# EAGLE design Arduino MEGA Ultimaker Shield v1.5.6 (EAGLE 5.10)
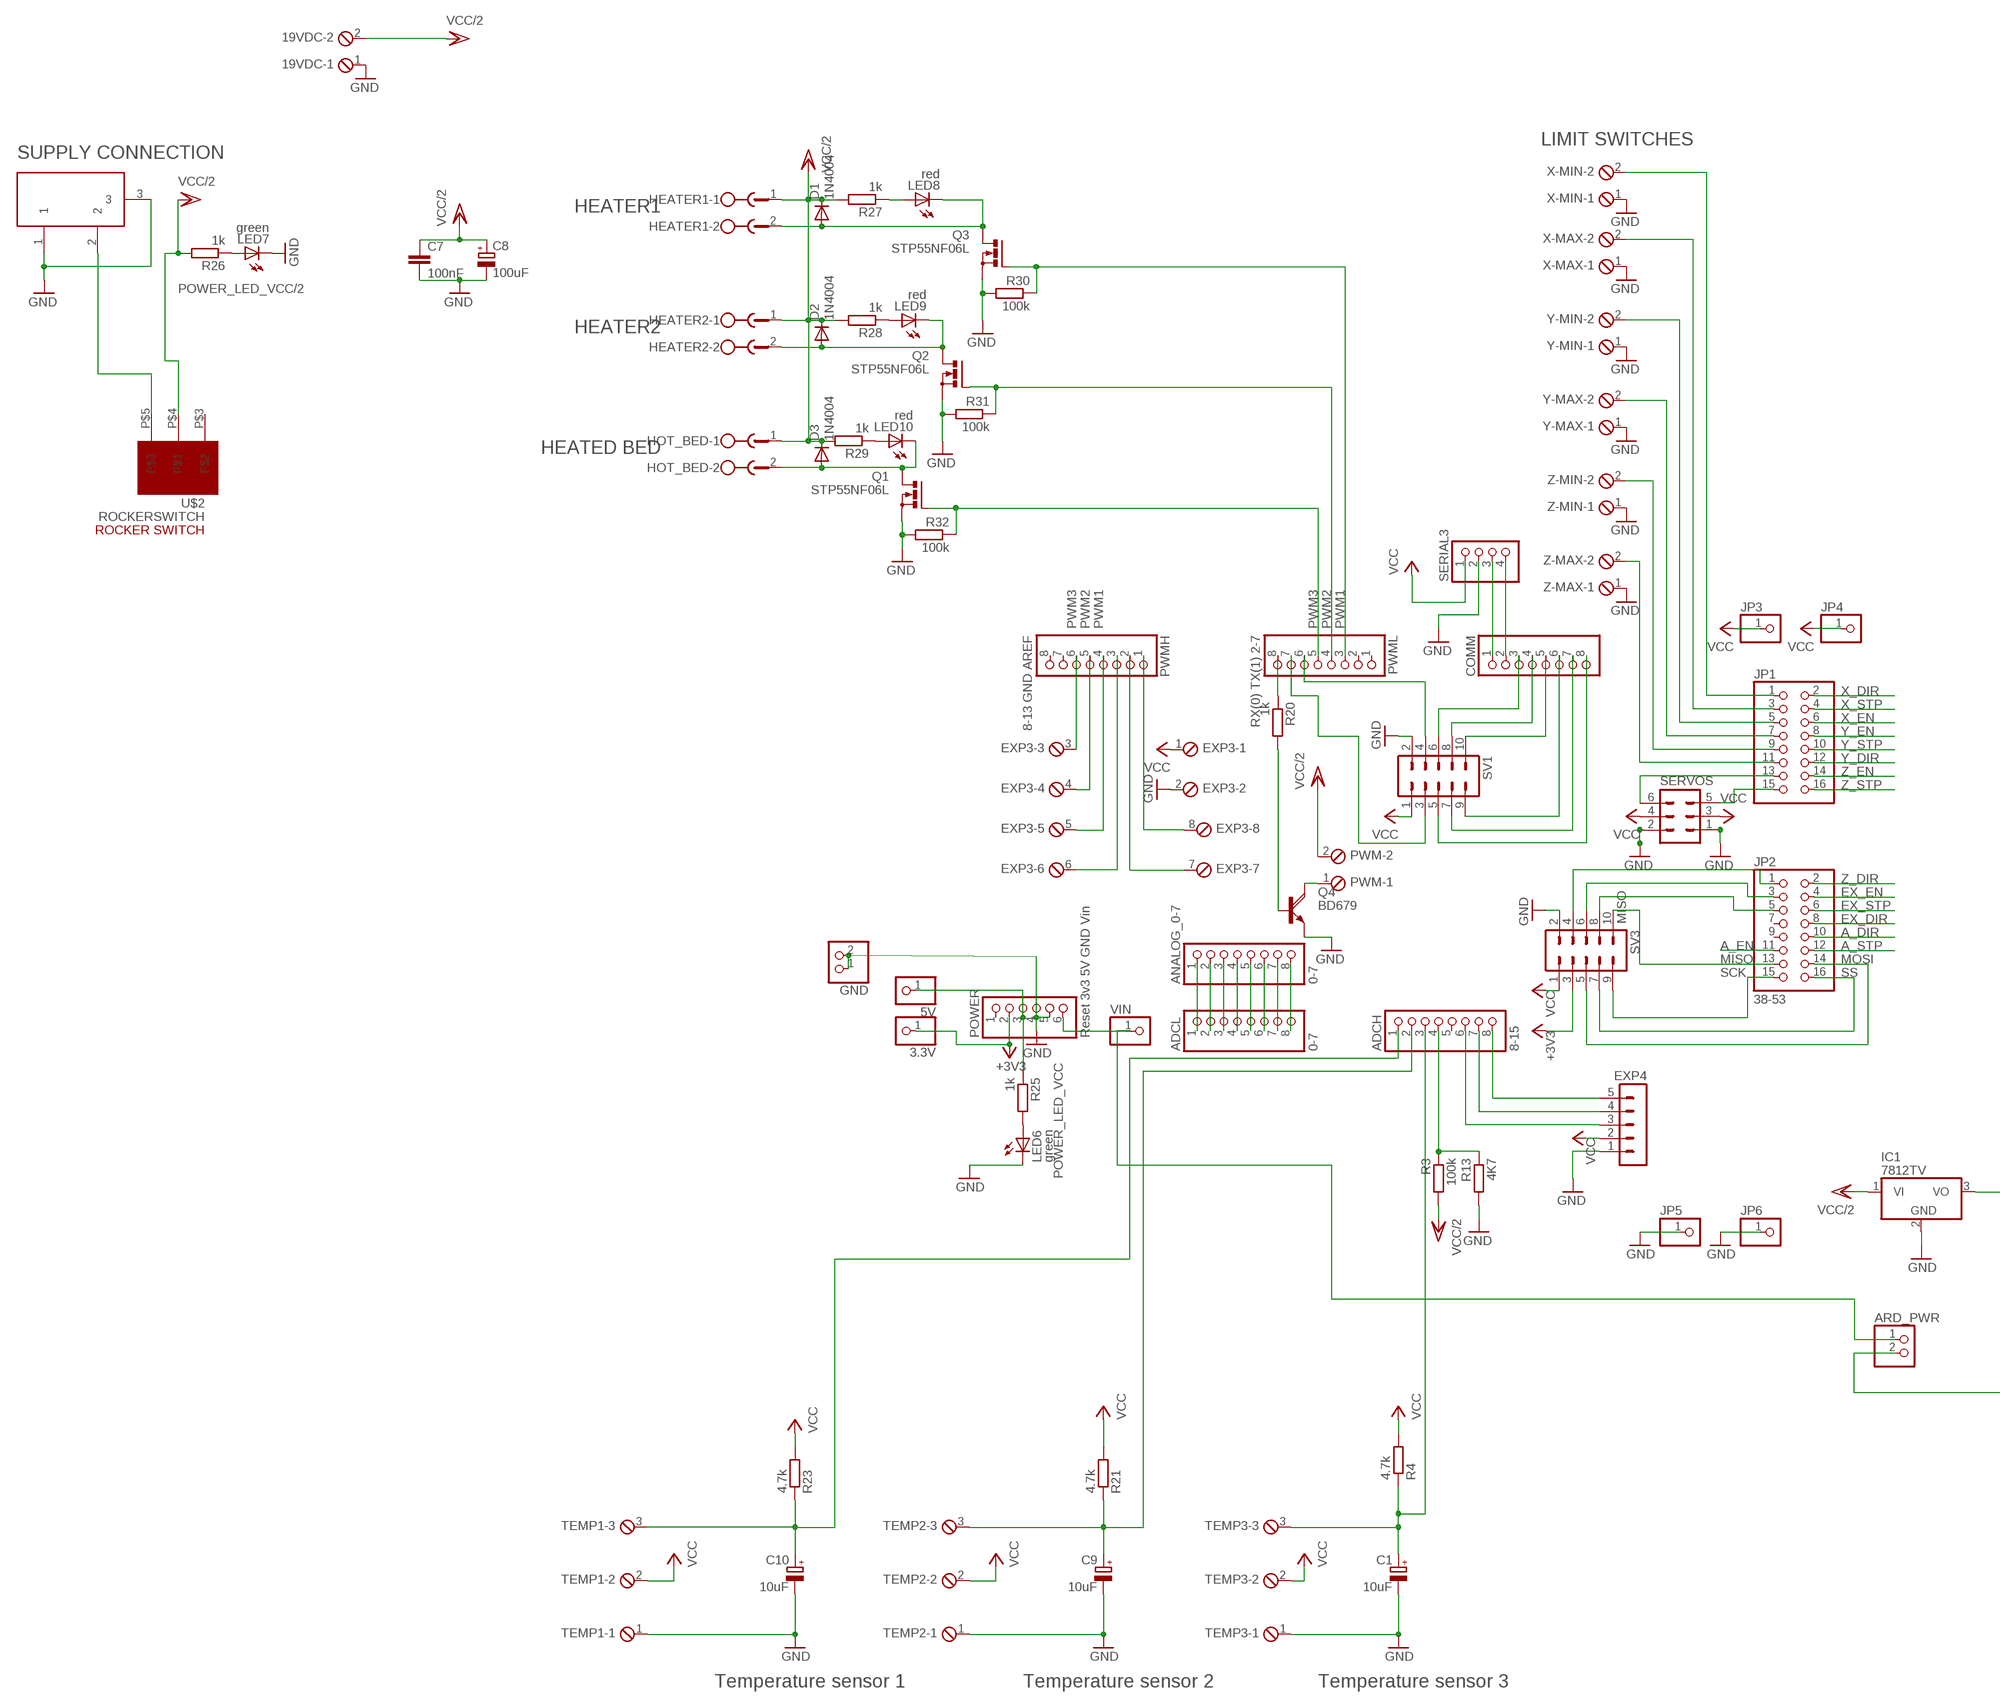
[diagram p0: schematic, sheet 1, part 1 of 2]
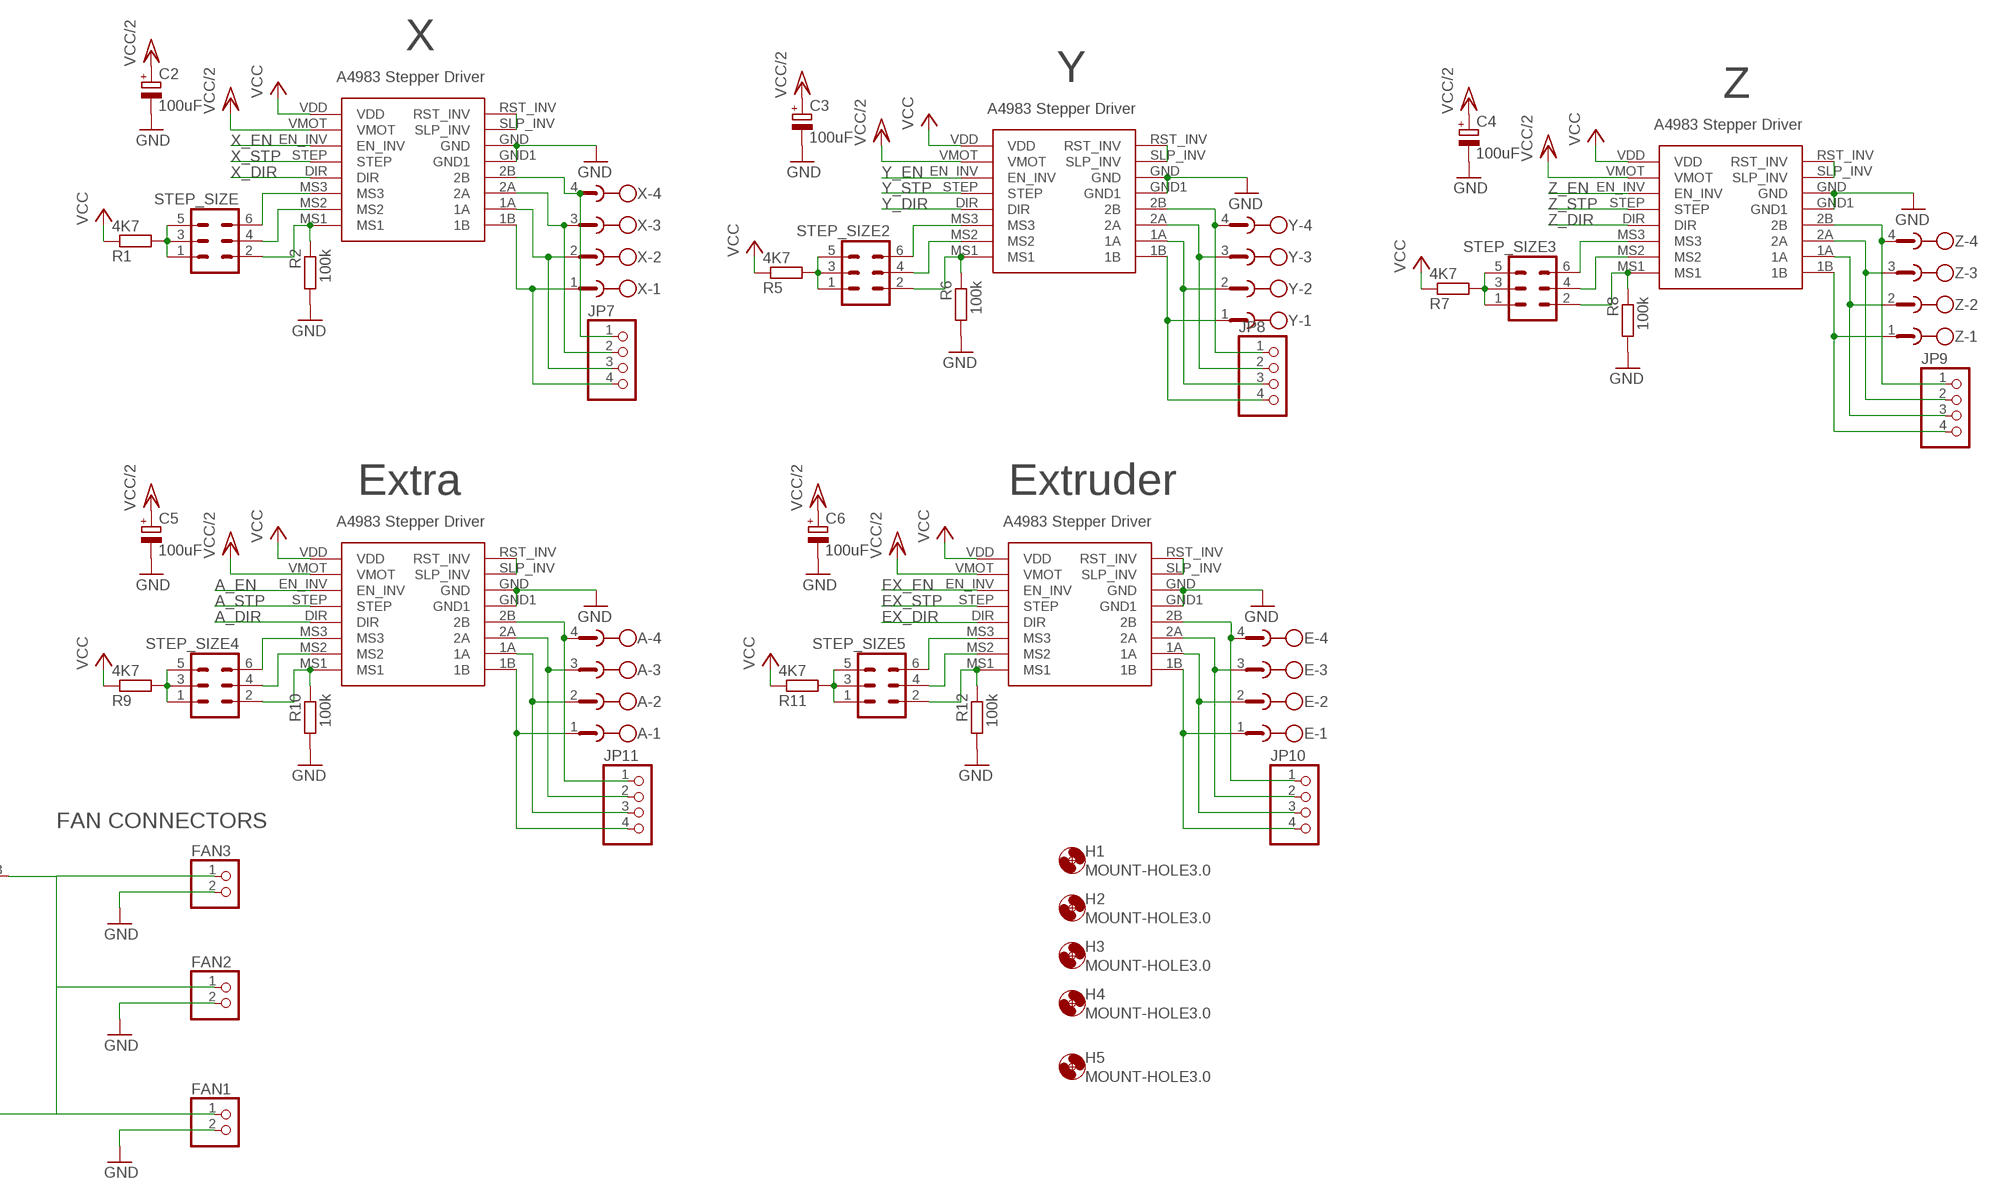
[diagram p1: schematic, sheet 1, part 2 of 2]

## Parts
3.3V  PINHD-1X1  [1X01]
5V  PINHD-1X1  [1X01]
19VDC  MPT2  [2POL254]
A  MSTBV4  [MSTBV4]
ADCH  8-15  PINHD-1X8  [1X08]
ADCL  0-7  PINHD-1X8  [1X08]
ANALOG_0-7  0-7  PINHD-1X8  [1X08]
ARD_PWR  PINHD-1X2  [1X02]
C1  10uF  CPOL-EUE2-5  [E2-5]
C2  100uF  CPOL-EUE3.5-10  [E3,5-10]
C3  100uF  CPOL-EUE3.5-10  [E3,5-10]
C4  100uF  CPOL-EUE3.5-10  [E3,5-10]
C5  100uF  CPOL-EUE3.5-10  [E3,5-10]
C6  100uF  CPOL-EUE3.5-10  [E3,5-10]
C7  100nF  C-EU050-045X075  [C050-045X075]
C8  100uF  CPOL-EUE3.5-8  [E3,5-8]
C9  10uF  CPOL-EUE2-5  [E2-5]
C10  10uF  CPOL-EUE2-5  [E2-5]
COMM  PINHD-1X8  [1X08]
D1  1N4004  [DO41-10]
D2  1N4004  [DO41-10]
D3  1N4004  [DO41-10]
E  MSTBV4  [MSTBV4]
EXP3  MPT8  [8POL254]
EXP4  MA05-1  [MA05-1]
FAN1  PINHD-1X2  [1X02]
FAN2  PINHD-1X2  [1X02]
FAN3  PINHD-1X2  [1X02]
GND  PINHD-1X2  [1X02]
H1  MOUNT-HOLE3.0  [3,0]
H2  MOUNT-HOLE3.0  [3,0]
H3  MOUNT-HOLE3.0  [3,0]
H4  MOUNT-HOLE3.0  [3,0]
H5  MOUNT-HOLE3.0  [3,0]
HEATER1  MSTBV2  [MSTBV2]
HEATER2  MSTBV2  [MSTBV2]
HOT_BED  MSTBV2  [MSTBV2]
IC1  7812TV  [TO220V]
JP1  PINHD-2X8  [2X08]
JP2  38-53  PINHD-2X8  [2X08]
JP3  PINHD-1X1  [1X01]
JP4  PINHD-1X1  [1X01]
JP5  PINHD-1X1  [1X01]
JP6  PINHD-1X1  [1X01]
JP7  PINHD-1X4  [1X04]
JP8  PINHD-1X4  [1X04]
JP9  PINHD-1X4  [1X04]
JP10  PINHD-1X4  [1X04]
JP11  PINHD-1X4  [1X04]
LED6  green  LED3MM  [LED3MM]
LED7  green  LED3MM  [LED3MM]
LED8  red  LED3MM  [LED3MM]
LED9  red  LED3MM  [LED3MM]
LED10  red  LED3MM  [LED3MM]
POWER  Reset 3v3 5V GND Vin  PINHD-1X6  [1X06]
PWM  MPT2  [2POL254]
PWMH  8-13 GND AREF  PINHD-1X8  [1X08]
PWML  RX(0) TX(1) 2-7  PINHD-1X8  [1X08]
Q1  STP55NF06L  IRF512  [TO220BV]
Q2  STP55NF06L  IRF512  [TO220BV]
Q3  STP55NF06L  IRF512  [TO220BV]
Q4  BD679  [TO126AV]
R1  4K7  R-EU_0204/7  [0204/7]
R2  100k  R-EU_0204/7  [0204/7]
R3  100k  R-EU_0207/2V  [0207/2V]
R4  4.7k  R-EU_0204/7  [0204/7]
R5  4K7  R-EU_0204/7  [0204/7]
R6  100k  R-EU_0204/7  [0204/7]
R7  4K7  R-EU_0204/7  [0204/7]
R8  100k  R-EU_0204/7  [0204/7]
R9  4K7  R-EU_0204/7  [0204/7]
R10  100k  R-EU_0204/7  [0204/7]
R11  4K7  R-EU_0204/7  [0204/7]
R12  100k  R-EU_0207/10  [0207/10]
R13  4K7  R-EU_0207/2V  [0207/2V]
R20  1k  R-EU_0207/2V  [0207/2V]
R21  4.7k  R-EU_0204/7  [0204/7]
R23  4.7k  R-EU_0204/7  [0204/7]
R25  1k  R-EU_0207/2V  [0207/2V]
R26  1k  R-EU_0204/7  [0204/7]
R27  1k  R-EU_0204/7  [0204/7]
R28  1k  R-EU_0204/7  [0204/7]
R29  1k  R-EU_0204/7  [0204/7]
R30  100k  R-EU_0204/7  [0204/7]
R31  100k  R-EU_0204/7  [0204/7]
R32  100k  R-EU_0204/7  [0204/7]
SERIAL3  PINHD-1X4  [1X04]
SERVOS  MA03-2  [MA03-2]
STEP_SIZE  MA03-2  [MA03-2]
STEP_SIZE2  MA03-2  [MA03-2]
STEP_SIZE3  MA03-2  [MA03-2]
STEP_SIZE4  MA03-2  [MA03-2]
STEP_SIZE5  MA03-2  [MA03-2]
SV1  MA05-2  [MA05-2]
SV3  MA05-2  [MA05-2]
TEMP1  MPT3  [3POL254]
TEMP2  MPT3  [3POL254]
TEMP3  MPT3  [3POL254]
U$1  A4983  [A4983]
U$2  ROCKERSWITCH  [PCBMOUNT]
U$4  A4983  [A4983]
U$5  A4983  [A4983]
U$6  A4983  [A4983]
U$7  A4983  [A4983]
VIN  PINHD-1X1  [1X01]
X  MSTBV4  [MSTBV4]
X2  DC21MMX  [DC-21MM]
X-MAX  MPT2  [2POL254]
X-MIN  MPT2  [2POL254]
Y  MSTBV4  [MSTBV4]
Y-MAX  MPT2  [2POL254]
Y-MIN  MPT2  [2POL254]
Z  MSTBV4  [MSTBV4]
Z-MAX  MPT2  [2POL254]
Z-MIN  MPT2  [2POL254]

## Nets
+3V3: 3.3V.1 POWER.2 SV3.3
A_DIR: JP2.10 U$6.DIR
A_EN: JP2.11 U$6.EN_INV
A_STP: JP2.12 U$6.STEP
EX_DIR: JP2.8 U$7.DIR
EX_EN: JP2.4 U$7.EN_INV
EX_STP: JP2.6 U$7.STEP
GND: 19VDC.1 C1.- C2.- C3.- C4.- C5.- C6.- C7.2 C8.- C9.- C10.- EXP3.2 EXP4.1 FAN1.2 FAN2.2 FAN3.2 GND.1 GND.2 IC1.2(GND) JP5.1 JP6.1 LED6.K(C) LED7.K(C) POWER.4 POWER.5 Q1.S Q2.S Q3.S Q4.E R2.2 R6.2 R8.2 R10.2 R12.2 R13.2 R30.2 R31.2 R32.2 SERIAL3.2 SERVOS.1 SERVOS.2 SV1.2 SV3.2 TEMP1.1 TEMP2.1 TEMP3.1 U$1.GND U$1.GND1 U$4.GND U$4.GND1 U$5.GND U$5.GND1 U$6.GND U$6.GND1 U$7.GND U$7.GND1 X2.1 X2.3 X-MAX.1 X-MIN.1 Y-MAX.1 Y-MIN.1 Z-MAX.1 Z-MIN.1
MISO: JP2.13 SV3.10
MOSI: JP2.14 SV3.5
N$1: R2.1 STEP_SIZE.2 U$1.MS1
N$2: U$1.RST_INV U$1.SLP_INV
N$3: STEP_SIZE.4 U$1.MS2
N$4: R1.2 STEP_SIZE.1 STEP_SIZE.3 STEP_SIZE.5
N$5: STEP_SIZE.6 U$1.MS3
N$6: JP7.1 U$1.2B X.4
N$7: JP1.1 X-MIN.2
N$8: JP7.2 U$1.2A X.3
N$9: JP7.3 U$1.1A X.2
N$10: JP7.4 U$1.1B X.1
N$11: JP1.3 X-MAX.2
N$12: JP1.5 Y-MIN.2
N$13: JP1.7 Y-MAX.2
N$14: JP1.9 Z-MIN.2
N$15: JP2.5 SV3.8
N$16: JP2.3 SV3.6
N$17: JP2.1 SV3.4
N$18: PWML.8 R20.1
N$19: R6.1 STEP_SIZE2.2 U$4.MS1
N$20: R5.2 STEP_SIZE2.1 STEP_SIZE2.3 STEP_SIZE2.5
N$21: STEP_SIZE2.4 U$4.MS2
N$22: STEP_SIZE2.6 U$4.MS3
N$23: JP8.2 U$4.2A Y.3
N$24: JP8.3 U$4.1A Y.2
N$25: JP8.4 U$4.1B Y.1
N$26: PWML.7 SV1.3
N$27: JP8.1 U$4.2B Y.4
N$28: U$4.RST_INV U$4.SLP_INV
N$29: R8.1 STEP_SIZE3.2 U$5.MS1
N$30: R7.2 STEP_SIZE3.1 STEP_SIZE3.3 STEP_SIZE3.5
N$31: STEP_SIZE3.4 U$5.MS2
N$32: STEP_SIZE3.6 U$5.MS3
N$33: JP9.2 U$5.2A Z.3
N$34: JP9.3 U$5.1A Z.2
N$35: JP9.4 U$5.1B Z.1
N$36: JP9.1 U$5.2B Z.4
N$37: U$5.RST_INV U$5.SLP_INV
N$38: R10.1 STEP_SIZE4.2 U$6.MS1
N$39: R9.2 STEP_SIZE4.1 STEP_SIZE4.3 STEP_SIZE4.5
N$40: STEP_SIZE4.4 U$6.MS2
N$41: STEP_SIZE4.6 U$6.MS3
N$42: A.3 JP11.2 U$6.2A
N$43: A.2 JP11.3 U$6.1A
N$44: A.1 JP11.4 U$6.1B
N$45: A.4 JP11.1 U$6.2B
N$46: U$6.RST_INV U$6.SLP_INV
N$47: R12.1 STEP_SIZE5.2 U$7.MS1
N$48: R11.2 STEP_SIZE5.1 STEP_SIZE5.3 STEP_SIZE5.5
N$49: STEP_SIZE5.4 U$7.MS2
N$50: STEP_SIZE5.6 U$7.MS3
N$51: E.3 JP10.2 U$7.2A
N$52: E.2 JP10.3 U$7.1A
N$53: E.1 JP10.4 U$7.1B
N$54: E.4 JP10.1 U$7.2B
N$55: U$7.RST_INV U$7.SLP_INV
N$56: Q4.B R20.2
N$57: COMM.5 SV1.10
N$58: D3.A HOT_BED.2 LED10.K(C) Q1.D
N$59: PWML.6 SV1.4
N$60: EXP3.8 PWMH.1
N$61: ARD_PWR.1 POWER.6 VIN.1
N$62: EXP3.7 PWMH.2
N$63: EXP3.6 PWMH.3
N$64: LED6.A R25.2
N$65: 5V.1 POWER.3 R25.1
N$66: LED7.A R26.1
N$67: U$2.P$5 X2.2
N$68: LED8.A R27.1
N$69: ADCH.4 R3.1 R13.1
N$70: ADCH.8 EXP4.5
N$71: ADCH.7 EXP4.4
N$72: ARD_PWR.2 FAN1.1 FAN2.1 FAN3.1 IC1.3(VO)
N$73: ADCL.1 ANALOG_0-7.1
N$74: ADCL.2 ANALOG_0-7.2
N$75: ADCL.3 ANALOG_0-7.3
N$76: ADCL.4 ANALOG_0-7.4
N$77: ADCL.5 ANALOG_0-7.5
N$78: ADCL.6 ANALOG_0-7.6
N$79: ADCL.7 ANALOG_0-7.7
N$80: ADCL.8 ANALOG_0-7.8
N$81: ADCH.6 EXP4.3
N$82: JP1.11 Z-MAX.2
N$84 [gnd]: JP1.13 SERVOS.6
N$85 [gnd]: JP1.15 SERVOS.5
N$86: COMM.2 SERIAL3.4
N$87: EXP3.5 PWMH.4
N$88: COMM.1 SERIAL3.3
N$89: LED9.A R28.1
N$90: EXP3.4 PWMH.5
N$91: EXP3.3 PWMH.6
N$92: PWM.1 Q4.C
N$94: COMM.6 SV1.9
N$95: COMM.7 SV1.7
N$96: COMM.8 SV1.5
N$97: COMM.4 SV1.8
N$98: COMM.3 SV1.6
N$106: D2.A HEATER2.2 LED9.K(C) Q2.D
N$107: D1.A HEATER1.2 LED8.K(C) Q3.D
N$108: LED10.A R29.1
PWM1: PWML.3 Q3.G R30.1
PWM2: PWML.4 Q2.G R31.1
PWM3: PWML.5 Q1.G R32.1
SCK: JP2.15 SV3.9
SS: JP2.16 SV3.7
THERMISTOR1: ADCH.1 C10.+ R23.1 TEMP1.3
THERMISTOR2: ADCH.2 C9.+ R21.1 TEMP2.3
THERMISTOR3: ADCH.3 C1.+ R4.1 TEMP3.3
VCC: EXP3.1 EXP4.2 JP3.1 JP4.1 R1.1 R4.2 R5.1 R7.1 R9.1 R11.1 R21.2 R23.2 SERIAL3.1 SERVOS.3 SERVOS.4 SV1.1 SV3.1 TEMP1.2 TEMP2.2 TEMP3.2 U$1.VDD U$4.VDD U$5.VDD U$6.VDD U$7.VDD
VCC/2 [vcc2]: 19VDC.2 C2.+ C3.+ C4.+ C5.+ C6.+ C7.1 C8.+ D1.C D2.C D3.C HEATER1.1 HEATER2.1 HOT_BED.1 IC1.1(VI) PWM.2 R3.2 R26.2 R27.2 R28.2 R29.2 U$1.VMOT U$2.P$4 U$4.VMOT U$5.VMOT U$6.VMOT U$7.VMOT
X_DIR: JP1.2 U$1.DIR
X_EN: JP1.6 U$1.EN_INV
X_STP: JP1.4 U$1.STEP
Y_DIR: JP1.12 U$4.DIR
Y_EN: JP1.8 U$4.EN_INV
Y_STP: JP1.10 U$4.STEP
Z_DIR: JP2.2 U$5.DIR
Z_EN: JP1.14 U$5.EN_INV
Z_STP: JP1.16 U$5.STEP
Unconnected: ADCH.5 JP2.7 JP2.9 POWER.1 PWMH.7 PWMH.8 PWML.1 PWML.2 U$2.P$3

## Notes on the sheet
- LIMIT SWITCHES
- SUPPLY CONNECTION
- HEATER1
- POWER_LED_VCC/2
- HEATER2
- HEATED BED
- X
- Y
- Z
- Extra | Extruder
- FAN CONNECTORS
- POWER_LED_VCC
- Temperature sensor 1 | Temperature sensor 2 | Temperature sensor 3

## Library data of the parts
3.3V 5V JP3-JP6 VIN = pinhead:PINHD-1X1: PIN HEADER
19VDC PWM X-MAX X-MIN Y-MAX Y-MIN Z-MAX Z-MIN = ultimaker-phoenix-mpt3-254:MPT2: PHOENIX CONNECTOR
A E X Y Z = con-phoenix-508:MSTBV4: PHOENIX
ADCH ADCL ANALOG_0-7 COMM PWMH PWML = pinhead:PINHD-1X8: PIN HEADER
ARD_PWR FAN1-FAN3 GND = pinhead:PINHD-1X2: PIN HEADER
C1-C6 C8-C10 = rcl:CPOL-EU: POLARIZED CAPACITOR, European symbol
C7 = rcl:C-EU: CAPACITOR, European symbol
D1-D3 = diode:1N4004: DIODE general purpose rectifier, 1 A
EXP3 = con-phoenix-254:MPT8: PHOENIX CONNECTOR
EXP4 = con-lstb:MA05-1: PIN HEADER
H1-H5 = holes:MOUNT-HOLE: MOUNTING HOLE with drill center marker
HEATER1 HEATER2 HOT_BED = con-phoenix-508:MSTBV2: PHOENIX
IC1 = linear:78*: Positive VOLTAGE REGULATOR Source: http://cache.national.com/ds/LM/LM78L05.pdf http://www.fairchildsemi.com/ds/LM/LM7805.pdf
JP1 JP2 = pinhead:PINHD-2X8: PIN HEADER
JP7-JP11 SERIAL3 = pinhead:PINHD-1X4: PIN HEADER
LED6 LED7 = led:LED: LED OSRAM: - CHIPLED LG R971, LG N971, LY N971, LG Q971, LY Q971, LO R971, LY R971 LH N974, LH R974 LS Q976, LO Q976, LY Q976 LO Q996 - Hyper CHIPLED LW Q18S LB Q993, LB Q99A, LB R99A - SideLED LS A670, LO A670, LY A670, LG A670, LP A670 LB A673, LV A673, LT A673, LW A673 LH A674 LY A675 LS A676, LA A676, LO A676, LY A676, LW A676 LS A679, LY A679, LG A679 - Hyper Micro SIDELED® LS Y876, LA Y876, LO Y876, LY Y876 LT Y87S - SmartLED LW L88C, LW L88S LB L89C, LB L89S, LG L890 LS L89K, LO L89K, LY L89K LS L896, LA L896, LO L896, LY L896 - TOPLED LS T670, LO T670, LY T670, LG T670, LP T670 LSG T670, LSP T670, LSY T670, LOP T670, LYG T670 LG T671, LOG T671, LSG T671 LB T673, LV T673, LT T673, LW T673 LH T674 LS T676, LA T676, LO T676, LY T676, LB T676, LH T676, LSB T676, LW T676 LB T67C, LV T67C, LT T67C, LS T67K, LO T67K, LY T67K, LW E67C LS E67B, LA E67B, LO E67B, LY E67B, LB E67C, LV E67C, LT E67C LW T67C LS T679, LY T679, LG T679 LS T770, LO T770, LY T770, LG T770, LP T770 LB T773, LV T773, LT T773, LW T773 LH T774 LS E675, LA E675, LY E675, LS T675 LS T776, LA T776, LO T776, LY T776, LB T776 LHGB T686 LT T68C, LB T68C - Hyper Mini TOPLED® LB M676 - Mini TOPLED Santana® LG M470 LS M47K, LO M47K, LY M47K Source: http://www.osram.convergy.de LUXEON: - LUMILED® LXK2-PW12-R00, LXK2-PW12-S00, LXK2-PW14-U00, LXK2-PW14-V00 LXK2-PM12-R00, LXK2-PM12-S00, LXK2-PM14-U00 LXK2-PE12-Q00, LXK2-PE12-R00, LXK2-PE12-S00, LXK2-PE14-T00, LXK2-PE14-U00 LXK2-PB12-K00, LXK2-PB12-L00, LXK2-PB12-M00, LXK2-PB14-N00, LXK2-PB14-P00, LXK2-PB14-Q00 LXK2-PR12-L00, LXK2-PR12-M00, LXK2-PR14-Q00, LXK2-PR14-R00 LXK2-PD12-Q00, LXK2-PD12-R00, LXK2-PD12-S00 LXK2-PH12-R00, LXK2-PH12-S00 LXK2-PL12-P00, LXK2-PL12-Q00, LXK2-PL12-R00 Source: www.luxeon.com KINGBRIGHT: KA-3528ASYC Source: www.kingbright.com
LED8-LED10 = SparkFun:LED: LEDs Standard schematic elements and footprints for 5mm, 3mm, 1206, and 0603 sized LEDs. 5mm - Spark Fun Electronics SKU : COM-00529 (and others)
POWER = pinhead:PINHD-1X6: PIN HEADER
Q1-Q3 = transistor-power:IRF512: N-CHANNEL MOS FET
Q4 = transistor-power:BD679: NPN DARLINGTON TRANSISTOR
R1 R3-R7 R9-R13 R20 R21 R23 R25-R32 = rcl:R-EU_: RESISTOR, European symbol
R2 R8 = resistor:R-EU_: RESISTOR, European symbol
SERVOS STEP_SIZE STEP_SIZE2-STEP_SIZE5 = con-lstb:MA03-2: PIN HEADER
SV1 SV3 = con-lstb:MA05-2: PIN HEADER
TEMP1-TEMP3 = ultimaker-phoenix-mpt3-254:MPT3: PHOENIX CONNECTOR
U$1 U$4-U$7 = A4983(JJ):A4983
U$2 = tyco-rockerswitch:ROCKERSWITCH
X2 = powersupply:DC21MM

## Net classes
0 default: width 0.254 mm, clearance 0.305 mm
1 signal: width 0.914 mm, clearance 0.406 mm
2 gnd: width 0.914 mm, drill 0.711 mm, clearance 0.305 mm
3 usbvcc: width 0.508 mm, drill 0.711 mm, clearance 0.305 mm
4 vcc2: width 0.914 mm, drill 0.305 mm, clearance 0.305 mm

## Board
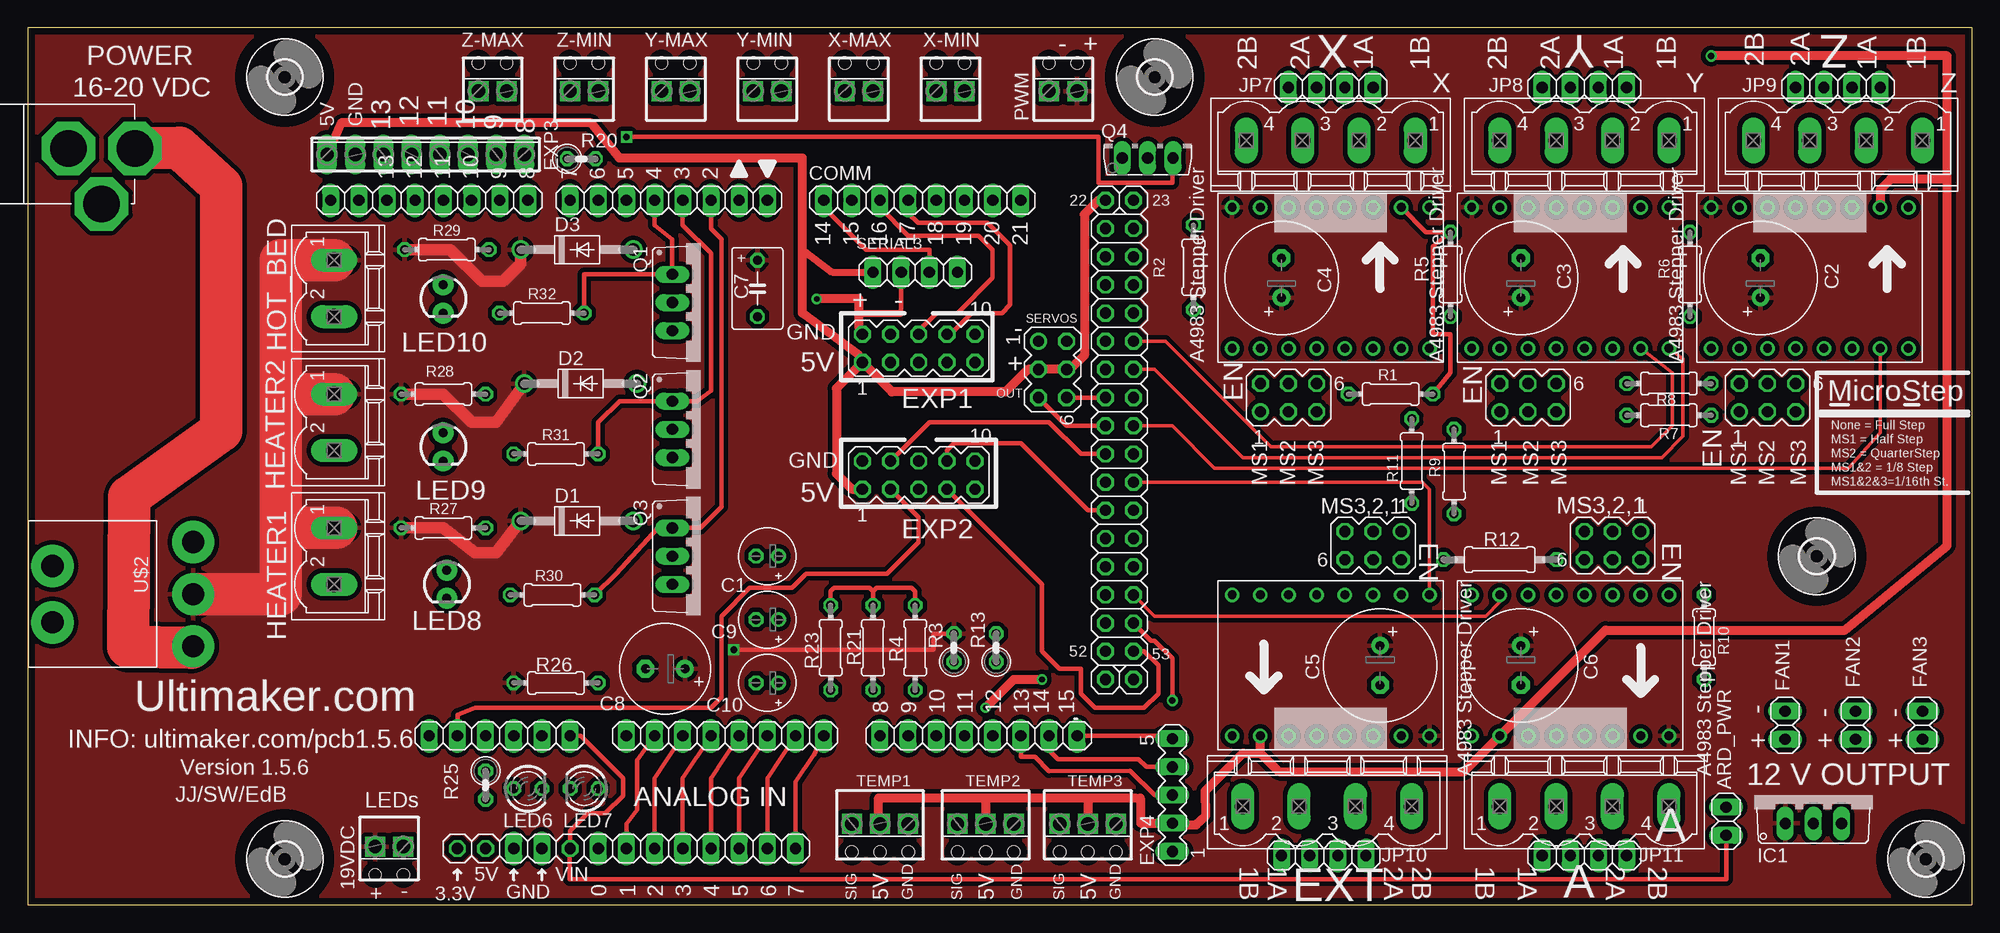
[diagram p2: board, top side]
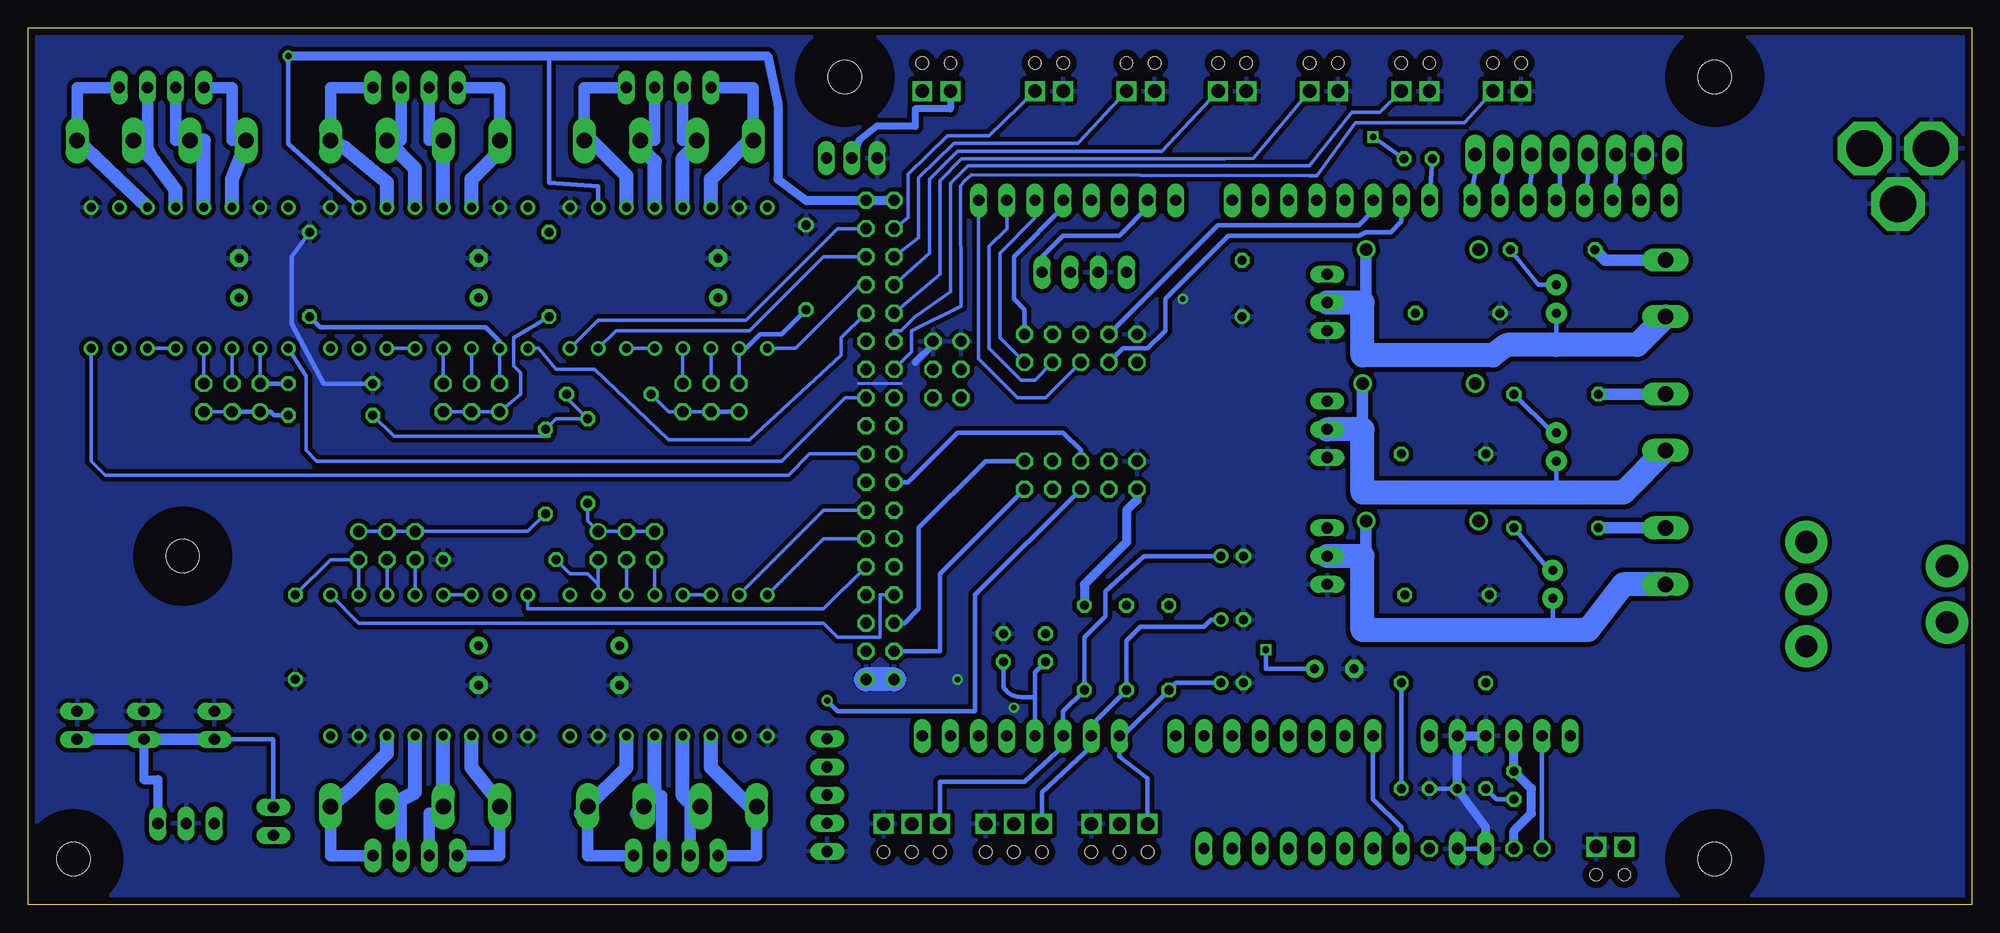
[diagram p3: board, bottom side, seen from below]

Size 175.26 x 79.06 mm. Coordinates in mm from the lower left corner, seen from the top.
Outline: 0,0 175.26,0 175.26,79.06
Outline: 175.25,79.05 0,79.05 0,0.01
Copper layers (1*16): Top 0.035mm / dielectric 1.5mm / Bottom 0.035mm
Design rules "default *": minimum track width 8mil, minimum drill 20mil, track to track 0.2mm, track to pad 0.2mm, pad to pad 0.2mm, via to via 0.2mm, smd to smd 8mil, copper to edge 25mil, drill to drill 12mil, minimum pad ring 10mil, minimum via ring 8mil, stop-mask expansion 4mil, vias tented up to drill 0mil, thermal gap 15mil

### Footprints (pad centres in the part's own frame; a part is rotated, then mirrored left to right if it is on the bottom)
1X01 = drill 1.016 octagon: 1 0,0
2POL254 = drill 1.2 square: 1 -1.27,0; 2 1.27,0 | hole 1.1: 1.27,2.54; -1.27,2.54
MSTBV4 = drill 1.397 long: 1 -7.62,0; 2 -2.54,0; 3 2.54,0; 4 7.62,0
1X08 = drill 1.016 long: 1 -8.89,0; 2 -6.35,0; 3 -3.81,0; 4 -1.27,0; 5 1.27,0; 6 3.81,0; 7 6.35,0; 8 8.89,0
1X02 = drill 1.016 long: 1 -1.27,0; 2 1.27,0
E2-5 = drill 0.813 pad 1.27 round: + -1.016,0 | drill 0.813 pad 1.27 octagon: - 1.016,0
E3,5-10 = drill 0.813 pad 1.6 round: + -1.778,0 | drill 0.813 pad 1.6 octagon: - 1.778,0
C050-045X075 = drill 0.813 octagon: 1 -2.54,0; 2 2.54,0
E3,5-8 = drill 0.813 pad 1.6 round: + -1.778,0 | drill 0.813 pad 1.6 octagon: - 1.778,0
DO41-10 = drill 1.118 round: A 5.08,0; C -5.08,0
8POL254 = drill 1.2 long: 1 -8.89,0; 2 -6.35,0; 3 -3.81,0; 4 -1.27,0; 5 1.27,0; 6 3.81,0; 7 6.35,0; 8 8.89,0
MA05-1 = drill 1.016 long: 1 -5.08,0; 2 -2.54,0; 3 0,0; 4 2.54,0; 5 5.08,0
3,0 = hole 3: 0,0
MSTBV2 = drill 1.397 long: 1 -2.54,0; 2 2.54,0
TO220V = drill 1.016 long: 1 -2.54,-2.54; 2 0,-2.54; 3 2.54,-2.54
2X08 = drill 1.016 octagon: 1 -8.89,-1.27; 2 -8.89,1.27; 3 -6.35,-1.27; 4 -6.35,1.27; 5 -3.81,-1.27; 6 -3.81,1.27; 7 -1.27,-1.27; 8 -1.27,1.27; 9 1.27,-1.27; 10 1.27,1.27; 11 3.81,-1.27; 12 3.81,1.27; 13 6.35,-1.27; 14 6.35,1.27; 15 8.89,-1.27; 16 8.89,1.27
1X04 = drill 1.016 long: 1 -3.81,0; 2 -1.27,0; 3 1.27,0; 4 3.81,0
LED3MM = drill 0.813 octagon: A -1.27,0; K 1.27,0
LED3MM' = drill 0.813 pad 1.88 round: A -1.27,0; K 1.27,0
1X06 = drill 1.016 long: 1 -6.35,0; 2 -3.81,0; 3 -1.27,0; 4 1.27,0; 5 3.81,0; 6 6.35,0
TO220BV = drill 1.016 long: D 0,-2.54; G -2.54,-2.54; S 2.54,-2.54
TO126AV = drill 1.016 long: B 2.286,-1.27; C 0,-1.27; E -2.286,-1.27
0204/7 = drill 0.813 octagon: 1 -3.81,0; 2 3.81,0
0207/2V = drill 0.813 octagon: 1 -1.27,0; 2 1.27,0
0207/10 = drill 0.813 octagon: 1 -5.08,0; 2 5.08,0
MA03-2 = drill 1.016 round: 1 -2.54,-1.27 | drill 1.016 octagon: 2 -2.54,1.27; 3 0,-1.27; 4 0,1.27; 5 2.54,-1.27; 6 2.54,1.27
MA05-2 = drill 1.016 octagon: 1 -5.08,-1.27; 2 -5.08,1.27; 3 -2.54,-1.27; 4 -2.54,1.27; 5 0,-1.27; 6 0,1.27; 7 2.54,-1.27; 8 2.54,1.27; 9 5.08,-1.27; 10 5.08,1.27
3POL254 = drill 1.2 square: 1 -2.54,0; 2 0,0; 3 2.54,0 | hole 1.1: -2.54,2.54; 0,2.54; 2.54,2.54
A4983 = drill 0.8 round: 1A 6.35,-1.27; 1B 6.35,-3.81; 2A 6.35,1.27; 2B 6.35,3.81; DIR -6.35,-8.89; EN_INV -6.35,8.89; GND 6.35,6.35; GND1 6.35,-8.89; MS1 -6.35,6.35; MS2 -6.35,3.81; MS3 -6.35,1.27; RST_INV -6.35,-1.27; SLP_INV -6.35,-3.81; STEP -6.35,-6.35; VDD 6.35,-6.35; VMOT 6.35,8.89
PCBMOUNT = drill 2 pad 3.81 round: P$1 2.159,0; P$2 7.239,0; P$3 0,12.7; P$4 4.699,12.7; P$5 9.398,12.7
DC-21MM = drill 3.302 pad 4.826 octagon: 1 -5.08,-3.353; 2 -0.076,-6.35; 3 -0.076,-0.356

### Placement (x,y rotation side)
3.3V  38.73,5.08 0 top
5V  41.27,5.08 0 top
19VDC  32.59,5.26 180 top
A  140.34,8.89 0 top
ADCH  85.72,15.24 0 top
ADCL  62.87,15.24 0 top
ANALOG_0-7  60.33,5.08 0 top
ARD_PWR  153.11,7.54 90 top
C1  66.67,31.43 180 top
C2  156.21,56.52 90 top
C3  134.62,56.52 90 top
C4  113.03,56.52 90 top
C5  121.92,21.59 270 top
C6  134.62,21.59 270 top
C7  65.79,55.56 270 top
C8  57.47,21.27 180 top
C9  66.67,25.72 180 top
C10  66.67,20 180 top
COMM  80.64,63.5 0 top
D1  49.53,34.61 0 top
D2  49.85,46.99 0 top
D3  49.53,59.05 0 top
E  117.16,8.89 0 top
EXP3  35.88,67.63 0 top
EXP4  103.19,9.9 90 top
FAN1  158.43,16.19 90 top
FAN2  164.78,16.19 90 top
FAN3  170.81,16.19 90 top
GND  45.09,5.08 0 top
H1  101.6,74.61 0 top
H2  171.13,4.13 0 top
H3  161.29,31.43 0 top
H4  23.18,74.61 0 top
H5  23.18,4.13 0 top
HEATER1  27.62,31.43 270 top
HEATER2  27.62,43.5 270 top
HOT_BED  27.62,55.56 270 top
IC1  160.98,9.88 0 top
JP1  98.42,52.07 270 top
JP2  98.42,31.75 270 top
JP3  97.16,63.5 0 top
JP4  99.69,63.5 0 top
JP5  97.16,20.32 0 top
JP6  99.69,20.32 0 top
JP7  117.47,73.66 0 top
JP8  140.34,73.66 0 top
JP9  163.19,73.66 0 top
JP10  116.84,4.45 180 top
JP11  140.34,4.45 180 top
LED6  45.09,10.48 0 top
LED7  50.16,10.48 180 top
LED8  red  [LED3MM']  37.78,28.89 270 top
LED9  red  [LED3MM']  37.47,41.27 270 top
LED10  red  [LED3MM']  37.47,54.61 270 top
POWER  42.55,15.24 0 top
PWM  93.34,73.34 0 top
PWMH  36.2,63.5 180 top
PWML  57.78,63.5 180 top
Q1  60.64,54.29 270 top
Q2  60.64,42.86 270 top
Q3  60.64,31.43 270 top
Q4  100.97,68.58 0 top
R1  122.87,46.04 180 top
R2  105.09,57.47 90 top
R3  83.5,23.18 90 top
R4  80.01,23.18 90 top
R5  128.27,56.83 270 top
R6  149.86,56.83 90 top
R7  147.96,44.13 0 top
R8  147.96,46.99 180 top
R9  128.59,39.05 270 top
R10  151.13,24.13 270 top
R11  124.78,40.01 270 top
R12  132.72,31.11 0 top
R13  87.31,23.18 90 top
R20  49.91,67.25 0 top
R21  76.2,23.18 90 top
R23  72.39,23.18 90 top
R25  41.27,10.79 270 top
R26  47.62,20 180 top
R27  37.47,33.97 180 top
R28  37.47,46.04 180 top
R29  37.78,59.05 180 top
R30  47.31,27.94 180 top
R31  47.62,40.64 180 top
R32  46.35,53.34 180 top
SERIAL3  80.01,57.02 0 top
SERVOS  92.39,48.26 270 top
STEP_SIZE  113.67,45.72 0 top
STEP_SIZE2  135.25,45.72 0 top
STEP_SIZE3  156.84,45.72 0 top
STEP_SIZE4  142.88,32.38 180 top
STEP_SIZE5  121.28,32.38 180 top
SV1  80.33,50.16 0 top
SV3  80.33,38.73 0 top
TEMP1  76.83,7.3 180 top
TEMP2  86.36,7.3 180 top
TEMP3  95.57,7.3 180 top
U$1  117.47,56.52 90 top
U$2  2.23,32.7 270 top
U$4  139.06,56.52 90 top
U$5  160.66,56.52 90 top
U$6  139.06,21.59 270 top
U$7  117.47,21.59 270 top
VIN  48.9,5.08 0 top
X  117.47,68.9 180 top
X2  3.3,68.26 90 top
X-MAX  74.93,73.34 0 top
X-MIN  83.19,73.34 0 top
Y  140.34,68.9 180 top
Y-MAX  58.42,73.34 0 top
Y-MIN  66.67,73.34 0 top
Z  163.19,68.9 180 top
Z-MAX  41.91,73.34 0 top
Z-MIN  50.16,73.34 0 top

### Tracks (layer width: path | path; a pad name or v marks a point on that pad's centre or on a via)
+3V3
  Top 0.406: POWER.2 38.73,17.14 40.32,17.78 61.59,17.78 62.55,18.73 62.55,26.04 65.09,28.57 68.9,28.57 70.17,29.84 77.47,29.84 80.33,32.7 80.33,34.92 SV3.3
  Bottom 0.406: 3.3V.1 POWER.2
A_DIR
  Bottom 0.305: JP2.10 103.5,26.67 130.18,26.67 U$6.DIR
A_EN
  Bottom 0.305: JP2.11 98.42,27.94 98.42,24.13 102.23,24.13 103.5,25.4 145.41,25.4 U$6.EN_INV
A_STP
  Top 0.305: JP2.12 101.6,26.04 131.44,26.04 132.72,27.3 U$6.STEP
EX_DIR
  Bottom 0.305: JP2.8 103.5,33.02 U$7.DIR
EX_EN
  Top 0.305: JP2.4 125.73,38.1 126.36,37.47 U$7.EN_INV
EX_STP
  Bottom 0.305: JP2.6 103.5,35.56 U$7.STEP
GND  (via drill 0.51)
  Top 0.254: SV1.2 74.93,52.07
  Top 0.406: 78.74,53.34 SERIAL3.2
  Top 0.61: 74.93,53.34 78.74,53.34
  Top 0.813: v86.36,17.78 88.9,20.32 v91.44,20.32 | 74.93,52.07 74.93,53.34 74.93,54.61 v71.12,54.61
  Bottom 0.254: 96.48,46.99 100.36,46.99
  Bottom 0.406: LED6.K LED7.K | GND.1 GND.2 | R8.2 148.59,46.99 151.45,52.39 151.45,58.42 R6.2
  Bottom 0.61: SERVOS.2 93.66,50.48 95.25,48.9
  Bottom 0.813: POWER.4 POWER.5 LED6.K 43.81,6.99 GND.1
  Bottom 2.184: JP5.1 JP6.1
  pour Bottom (isolate 0.406): 0,79.05 175.26,79.05 175.26,0 0,0
MISO
  Bottom 0.406: JP2.13 96.2,25.4 94.93,26.67 94.93,33.97 88.9,40.01 SV3.10
MOSI  (via drill 0.6)
  Top 0.406: JP2.14 101.28,23.81 101.6,23.81 103.19,22.23 v103.19,18.41
  Bottom 0.406: v103.19,18.41 102.23,17.46 89.85,17.46 89.85,27.94 SV3.5
N$1
  Bottom 0.305: STEP_SIZE.2 U$1.MS1
  Bottom 0.406: R2.1 107.31,51.44 109.22,51.44 110.49,50.16 U$1.MS1
N$2
  Bottom 0.305: U$1.RST_INV U$1.SLP_INV
N$3
  Bottom 0.305: STEP_SIZE.4 U$1.MS2
N$4
  Bottom 0.305: STEP_SIZE.3 STEP_SIZE.5 117.47,44.45 R1.2
  Bottom 0.406: STEP_SIZE.1 STEP_SIZE.3
N$5
  Bottom 0.305: STEP_SIZE.6 U$1.MS3
N$6
  Bottom 1.016: 109.86,69.22 109.86,73.66 JP7.1
  Bottom 1.27: X.4 109.86,69.22 113.67,65.41 U$1.2B
N$7
  Bottom 0.305: X-MIN.2 88.58,69.34 92.33,69.34 95.89,65.85 95.89,61.91 JP1.1
N$8
  Bottom 1.016: X.3 116.2,68.9 JP7.2
  Bottom 1.27: X.3 114.94,68.58 116.2,67.31 U$1.2A
N$9
  Bottom 1.016: X.2 118.75,68.9 JP7.3
  Bottom 1.27: X.2 120.02,68.26 118.75,66.99 U$1.1A
N$10
  Bottom 1.016: 125.09,69.22 125.09,73.66 JP7.4
  Bottom 1.27: X.1 125.09,69.22 125.09,69.53 121.28,65.72 U$1.1B
N$11
  Bottom 0.305: X-MAX.2 80.58,68.64 91.76,68.64 94.93,65.53 94.93,60.13 JP1.3
N$12
  Bottom 0.305: Y-MIN.2 73.03,67.94 91.44,67.94 93.98,65.41 93.98,58.74 JP1.5
N$13
  Bottom 0.305: Y-MAX.2 64.77,67.31 67.31,67.25 91.06,67.25 93.03,65.28 93.03,56.83 JP1.7
N$14
  Bottom 0.305: Z-MIN.2 53.34,71.44 55.88,71.44 59.69,66.61 90.49,66.61 92.08,65.02 92.08,55.24 95.25,53.02 96.52,51.75 97.16,51.75 JP1.9
N$15
  Top 0.406: SV3.8 82.87,40.96 83.5,41.59 89.53,41.59 95.57,35.56 JP2.5
N$16
  Bottom 0.406: SV3.6 80.33,40.96 81.92,42.55 91.44,42.55 95.89,38.1 JP2.3
N$17
  Top 0.406: JP2.1 94.93,40.64 92.08,43.5 81.28,43.5 SV3.4
N$18
  Bottom 0.406: PWML.8 R20.1
N$19
  Bottom 0.305: STEP_SIZE2.2 U$4.MS1
  Bottom 0.406: U$4.MS1 132.72,50.8 133.99,52.07 148.91,52.07 R6.1
N$20
  Bottom 0.305: STEP_SIZE2.5 STEP_SIZE2.3 STEP_SIZE2.1 130.81,46.04 130.81,47.94 131.44,48.58 131.44,51.12 R5.2
N$21
  Bottom 0.305: STEP_SIZE2.4 U$4.MS2
N$22
  Bottom 0.305: STEP_SIZE2.6 U$4.MS3
N$23
  Bottom 1.016: Y.3 139.06,68.9 JP8.2
  Bottom 1.27: U$4.2A Y.3
N$24
  Bottom 1.016: Y.2 141.6,68.9 JP8.3
  Bottom 1.27: Y.2 140.34,66.36 U$4.1A
N$25
  Bottom 1.016: 146.69,68.26 147.96,68.26 147.96,73.66 JP8.4
  Bottom 1.27: Y.1 146.69,68.26 142.88,65.09 U$4.1B
N$26
  Bottom 0.406: SV1.3 76.52,50.16 74.3,50.16 72.71,51.75 72.71,54.61 66.99,60.33 55.24,60.33 54.61,60.64 52.39,60.64 51.44,61.59 PWML.7
N$27
  Bottom 1.016: Y.4 132.72,73.66 JP8.1
  Bottom 1.27: Y.4 132.72,67.94 135.25,65.41 U$4.2B
N$28
  Bottom 0.305: U$4.RST_INV U$4.SLP_INV
N$29
  Bottom 0.305: STEP_SIZE3.2 U$5.MS1
  Bottom 0.406: R8.1 STEP_SIZE3.2
N$30
  Bottom 0.305: STEP_SIZE3.3 STEP_SIZE3.5
  Bottom 0.406: STEP_SIZE3.3 STEP_SIZE3.1 153.35,44.45 153.03,44.13 R7.2
N$31
  Bottom 0.305: STEP_SIZE3.4 U$5.MS2
N$32
  Bottom 0.305: STEP_SIZE3.6 U$5.MS3
N$33
  Bottom 1.016: 159.38,68.9 161.93,68.9 JP9.2
  Bottom 1.27: Z.3 159.38,68.9 U$5.2A
N$34
  Bottom 1.016: 163.83,66.99 164.47,68.26 JP9.3
  Bottom 1.27: Z.2 163.83,66.99 161.93,64.45 U$5.1A
N$35
  Bottom 1.016: Z.1 170.81,73.66 JP9.4
  Bottom 1.27: U$5.1B Z.1
N$36
  Bottom 1.016: Z.4 156.84,68.9 156.84,73.66 JP9.1
  Bottom 1.27: Z.4 155.57,68.58 156.84,65.41 U$5.2B
N$37
  Bottom 0.305: U$5.RST_INV U$5.SLP_INV
N$38
  Bottom 0.305: U$6.MS1 STEP_SIZE4.2 147.96,31.11 R10.1
N$39
  Bottom 0.305: STEP_SIZE4.1 STEP_SIZE4.3 STEP_SIZE4.5 130.18,33.66 R9.2
N$40
  Bottom 0.305: U$6.MS2 STEP_SIZE4.4
N$41
  Bottom 0.305: U$6.MS3 STEP_SIZE4.6
N$42
  Bottom 1.016: JP11.2 141.6,8.89 A.3
  Bottom 1.27: A.3 140.34,10.16 U$6.2A
N$43
  Bottom 1.016: JP11.3 139.06,8.26 137.79,8.26 A.2
  Bottom 1.27: A.2 U$6.1A
N$44
  Bottom 1.016: 132.72,9.21 132.72,4.45 JP11.4
  Bottom 1.27: A.1 132.72,9.21 135.25,12.38 U$6.1B
N$45
  Bottom 1.016: JP11.1 147.96,4.45 A.4
  Bottom 1.27: A.4 146.05,10.48 142.88,13.65 U$6.2B
N$46
  Bottom 0.305: U$6.SLP_INV U$6.RST_INV
N$47
  Bottom 0.305: STEP_SIZE5.2 U$7.MS1 123.83,28.89 124.78,29.84 126.36,29.84 R12.1
N$48
  Bottom 0.305: STEP_SIZE5.5 STEP_SIZE5.3 STEP_SIZE5.1 124.78,34.61 R11.2
N$49
  Bottom 0.305: U$7.MS2 STEP_SIZE5.4
N$50
  Bottom 0.305: U$7.MS3 STEP_SIZE5.6
N$51
  Bottom 1.016: 118.75,9.84 118.11,9.84 JP10.2
  Bottom 1.27: 120.33,8.26 E.3 118.75,9.84 U$7.2A
N$52
  Bottom 1.016: E.2 115.57,8.89 JP10.3
  Bottom 1.27: E.2 115.25,8.89 116.2,9.84 U$7.1A
N$53
  Bottom 1.016: JP10.4 109.54,4.45 E.1
  Bottom 1.27: E.1 110.17,8.89 113.67,12.38 U$7.1B
N$54
  Bottom 1.016: JP10.1 124.78,4.45 E.4
  Bottom 1.27: 125.41,8.26 E.4 121.28,12.38 U$7.2B
N$55
  Bottom 0.305: U$7.SLP_INV U$7.RST_INV
N$56  (via drill 0.6)
  Top 0.406: v53.98,69.22 96.52,69.22 96.52,65.09 103.19,65.09 Q4.B
  Bottom 0.406: R20.2 v53.98,69.22
N$57
  Bottom 0.406: SV1.10 85.41,53.66 86.36,54.61 86.36,58.42 81.92,62.87 COMM.5
N$58
  Bottom 0.406: 37.47,50.48 LED10.K
  Bottom 1.016: Q1.D 54.61,54.29 D3.A
  Bottom 2.184: Q1.D 54.93,54.29 54.93,49.53 43.18,49.53 41.91,50.48 37.47,50.48 30.16,50.48 HOT_BED.2
N$59
  Bottom 0.406: PWML.6 53.98,62.55 55.24,61.28 67.94,61.28 SV1.4
N$60
  Bottom 0.406: EXP3.8 44.77,66.04 45.09,64.45 PWMH.1
N$61
  Top 0.406: POWER.6 49.85,15.24 53.66,11.43 53.66,9.84 52.07,8.26 50.48,8.26 48.9,6.67 VIN.1 48.87,5.06 48.87,2.29 153.11,2.29 ARD_PWR.1
N$62
  Bottom 0.406: EXP3.7 42.23,66.04 42.55,64.45 PWMH.2
N$63
  Bottom 0.406: EXP3.6 39.69,65.72 PWMH.3
N$64
  Bottom 0.406: R25.2 42.86,9.53 LED6.A
N$65
  Bottom 0.813: 5V.1 41.27,6.67 39.69,8.26 39.69,10.48 R25.1 POWER.3
N$66
  Bottom 0.406: LED7.A R26.1
N$67
  Top 0.254: 14.73,23.18 U$2.P$5
  Top 3.81: 14.73,23.18 9.04,23.28 9.14,36.79 17.46,42.73 17.46,64.77 13.65,68.26 X2.2
N$68
  Bottom 0.406: LED8.A 38.1,30.16 R27.1
N$69
  Bottom 0.406: R3.1 84.45,20.95 ADCH.4 84.45,18.73 85.72,18.73 arc62 87.31,19.68 R13.1
N$70
  Top 0.406: ADCH.8 103.19,15.24 EXP4.5
N$71
  Top 0.406: ADCH.7 92.08,14.61 92.07,14.61 92.07,13.95 92.09,13.95 92.9,13.14 100.14,13.14 100.84,12.44 EXP4.4
N$72
  Bottom 0.406: ARD_PWR.2 153.14,8.81 153.14,14.91 158.94,14.91 158.94,14.92 | IC1.3
  Bottom 0.813: IC1.3 163.52,11.28 164.78,11.28 FAN2.1
  Bottom 1.016: FAN1.1 158.94,14.92 FAN2.1 FAN3.1
N$73
  Bottom 0.406: ADCL.1 53.98,9.53 51.44,6.99 ANALOG_0-7.1
N$74
  Top 0.406: ANALOG_0-7.2 53.98,7.3 54.93,8.57 54.93,13.02 ADCL.2
N$75
  Top 0.406: ANALOG_0-7.3 56.52,11.43 ADCL.3
N$76
  Top 0.406: ANALOG_0-7.4 59.05,11.43 ADCL.4
N$77
  Top 0.406: ANALOG_0-7.5 61.59,11.43 ADCL.5
N$78
  Top 0.406: ANALOG_0-7.6 64.14,11.43 ADCL.6
N$79
  Top 0.406: ANALOG_0-7.7 66.67,11.43 ADCL.7
N$80
  Top 0.406: ANALOG_0-7.8 69.22,11.11 70.87,13.59 70.87,13.53 ADCL.8
N$81
  Top 0.406: ADCH.6 89.53,13.34 90.81,13.34 92.08,12.06 99.39,12.09 101.61,9.86 103.19,9.86 EXP4.3
N$82
  Bottom 0.305: Z-MAX.2 45.72,70.48 55.56,70.48 59.05,65.72 59.69,65.72 90.17,65.79 90.87,65.22 91.19,64.77 91.12,53.98 95.57,51.75 95.57,49.85 JP1.11
N$84
  Top 0.406: SERVOS.6 JP1.13
N$85
  Top 0.406: SERVOS.5 93.66,43.18 JP1.15
N$86
  Bottom 0.406: COMM.2 74.3,62.87 76.83,60.33 81.92,60.33 83.82,58.42 SERIAL3.4
N$87
  Bottom 0.406: EXP3.5 37.15,65.09 PWMH.4
N$88
  Top 0.406: COMM.1 71.75,62.87 75.56,59.05 81.28,59.05 SERIAL3.3
N$89
  Bottom 0.406: LED9.A 37.78,42.55 R28.1
N$90
  Bottom 0.406: EXP3.4 34.61,65.41 PWMH.5
N$91
  Bottom 0.406: PWMH.6 32.07,65.41 EXP3.3
N$92
  Bottom 0.61: Q4.C 100.33,68.9 98.74,70.17 95.25,70.17 95.25,71.75 92.08,71.75 PWM.1
N$94
  Bottom 0.305: SV1.9 87.63,51.12 87.63,58.74 84.45,61.91 COMM.6
N$95
  Bottom 0.305: COMM.7 87,60.96 88.58,59.37 88.58,50.16 85.72,47.31 84.45,47.31 SV1.7
N$96
  Bottom 0.305: SV1.5 83.5,45.72 86.04,45.72 89.53,49.21 COMM.8
N$97
  Top 0.406: COMM.4 79.38,62.36 80.26,61.47 86.53,61.47 88.57,59.44 88.57,54.09 87.82,53.34 85.09,53.34 83.25,51.5 82.8,51.5 SV1.8
N$98
  Top 0.406: 76.83,62.87 76.83,62.61 | 76.83,62.87 COMM.3 | SV1.6 80.26,51.5 80.26,51.69 81.92,53.34 83.82,53.34 87,56.52 87,59.05 85.72,60.33 79.38,60.33 76.83,62.87
N$106
  Bottom 0.406: 37.47,37.15 LED9.K
  Bottom 1.016: 54.93,42.86 D2.A
  Bottom 2.184: Q2.D 54.93,42.86 54.93,37.15 37.47,37.15 31.43,37.15 HEATER2.2
N$107
  Bottom 0.406: 37.78,24.77 LED8.K
  Bottom 1.016: Q3.D 54.61,31.43 D1.A
  Bottom 2.184: HEATER1.2 31.43,28.89 34.61,24.77 37.78,24.77 54.93,24.77 54.93,31.43 Q3.D
N$108
  Bottom 0.406: LED10.A 39.05,55.88 R29.1
PWM1
  Top 0.406: PWML.3 61.59,60.96 62.55,60.01 62.55,35.88 60.64,33.97 Q3.G 56.83,33.97 53.02,29.84 R30.1
PWM2
  Top 0.406: PWML.4 59.05,61.28 61.59,58.74 61.59,46.35 60.33,45.4 Q2.G 53.34,45.4 51.44,43.5 R31.1
PWM3
  Top 0.406: PWML.5 56.52,61.28 58.1,60.01 Q1.G 50.16,56.83 R32.1
SCK
  Bottom 0.406: JP2.15 93.03,22.86 93.03,29.84 SV3.9
SS
  Top 0.406: JP2.16 100.65,22.86 101.92,21.59 101.92,19.05 100.65,17.78 96.2,17.78 94.93,19.05 94.93,21.27 93.03,21.27 91.44,22.86 91.44,28.89 SV3.7
THERMISTOR1
  Bottom 0.406: C10.+ 71.75,20 R23.1 76.52,15.24 ADCH.1 76.83,13.34 74.3,11.43 TEMP1.3
THERMISTOR2
  Bottom 0.406: C9.+ 68.58,25.72 69.22,25.08 74.93,25.08 76.2,23.81 R21.1 79.38,16.19 ADCH.2 79.38,14.29 83.82,10.16 TEMP2.3
THERMISTOR3
  Bottom 0.406: C1.+ 74.61,31.43 78.11,28.26 78.11,26.04 80.01,24.13 R4.1 81.92,17.46 ADCH.3 81.92,14.29 85.41,11.11 93.03,11.11 TEMP3.3
VCC  (via drill 0.6)
  Top 0.254: EXP3.1 26.99,67.94 | SV1.1 74.93,49.53 | 93.98,48.26 SERVOS.4 | JP3.1 96.52,63.5
  Top 0.406: v151.76,76.52 151.45,76.52 | R23.2 72.39,28.26 72.71,28.57 75.88,28.57 76.2,28.26 | 76.2,28.26 R21.2 | R4.2 80.01,28.26 79.69,28.57 76.52,28.57 76.2,28.26 | R1.1 128.27,47.94 128.27,51.44 126.68,51.44 126.68,59.37 R5.1 126.05,60.64 U$1.VDD | TEMP1.2 76.83,6.99
  Top 0.61: SERIAL3.1 72.52,57.02 69.85,59.05
  Top 0.813: 173.04,65.41 173.04,76.52 v151.76,76.52 | 173.04,65.41 173.04,32.38 163.83,24.77 142.24,24.77 U$6.VDD 129.47,12 112.81,12 111.12,13.69 | U$5.VDD 167,64.45 167.96,65.41 173.04,65.41 | SERVOS.4 SERVOS.3 90.17,48.26 88.14,46.23 77.92,46.23 SV1.1 72.9,46.55 72.9,38.86 74.3,37.47 SV3.1 | EXP3.1 28.26,70.48 50.8,70.48 53.34,67.31 69.85,67.31 69.85,59.05 69.85,53.34 74.93,49.53 | 93.98,48.26 95.25,49.53 95.25,62.23 96.52,63.5 | 76.71,9.65 76.72,9.62 | 76.71,9.65 76.71,7.3 TEMP1.2 | 76.71,9.65 86.36,9.65 | 86.36,9.65 TEMP2.2 | 95.57,9.64 95.57,9.65 86.36,9.65 | 111.12,13.69 U$7.VDD | 111.12,13.69 109.57,13.69 106.17,10.29 106.2,8.04 105.33,7.21 103.19,7.21 EXP4.2 100.32,7.37 100.31,9.62 99.83,9.64 95.57,9.64 | 95.57,9.64 TEMP3.2
  Bottom 0.305: R7.1 142.24,42.23 128.27,42.23 R9.1 127.64,43.81 R11.1 126.68,45.72 R1.1
  Bottom 0.406: U$4.VDD 151.76,68.58 v151.76,76.52 | U$1.VDD 123.83,64.77 128.27,65.09 128.27,76.52
  Bottom 0.813: JP3.1 JP4.1 105.09,63.5 107.63,65.41 107.63,72.07 108.58,76.52 128.27,76.52 v151.76,76.52 | SV3.1 75.25,36.51 76.2,35.56 76.2,32.7 80.01,28.89 R4.2
VCC/2  (via drill 0.6)
  Top 0.406: v63.64,23 81.66,23 81.66,24.43 83.5,24.43 R3.2
  Top 1.016: R29.2 38.1,59.05 40.96,56.2 42.86,56.2 44.45,57.78 D3.C | R27.2 37.47,33.97 40.32,31.75 42.23,31.75 D1.C | R28.2 37.47,46.04 40.01,43.5 42.23,43.5 D2.C
  Top 3.81: U$2.P$4 22.81,28 22.81,34 | 22.81,34 27.62,34 | 27.62,34 27.81,34 | 27.62,34 HEATER1.1 | 22.81,46.04 HEATER2.1 | 22.81,34 22.81,46.04 | HOT_BED.1 22.81,58.1 22.81,46.04
  Bottom 0.406: C8.+ 63.64,21.27 v63.64,23
  Bottom 1.016: R29.2 33.02,58.1 HOT_BED.1 | HEATER1.1 R27.2 | HEATER2.1 R28.2
  pour Top (isolate 0.406): 0,79.05 175.26,79.06 175.26,0 0,0
X_DIR
  Bottom 0.305: JP1.2 102.23,60.96 110.49,52.7 123.83,52.7 U$1.DIR
X_EN
  Bottom 0.305: JP1.6 100.33,55.88 106.05,50.16 U$1.EN_INV
X_STP
  Bottom 0.305: JP1.4 103.5,58.42 110.17,51.75 122.24,51.75 U$1.STEP
Y_DIR
  Top 0.305: JP1.12 101.6,48.26 109.54,40.32 147.32,40.32 149.22,42.23 149.22,49.21 U$4.DIR
Y_EN
  Bottom 0.305: JP1.8 101.92,51.12 101.92,49.53 110.17,41.91 117.47,41.91 124.14,48.26 127.64,48.26 129.22,50.16 U$4.EN_INV
Y_STP
  Top 0.305: JP1.10 102.55,50.8 112.08,41.27 146.37,41.27 148.27,43.18 148.27,47.94 U$4.STEP
Z_DIR
  Bottom 0.305: JP2.2 104.78,40.64 106.68,38.73 168.28,38.73 169.54,40.01 U$5.DIR
Z_EN
  Bottom 0.305: JP1.14 101.6,45.72 107.31,40.01 149.22,40.01 150.18,40.96 150.18,47.62 U$5.EN_INV
Z_STP
  Top 0.305: JP1.16 103.19,43.18 107,39.37 164.15,39.37 167,42.55 U$5.STEP

### Text on the board
tPlace: 13 | 12 | 11 | 10 | 9 | 8 | 7 | 6 | 5 | 4 | 3 | 2 | 14 | 15 | 16 | 17 | 18 | 19 | 20 | 21 | 8 | 9 | 10 | 11 | 12 | 13 | 14 | 15 | 0 | 1 | 2 | 3 | 4 | 5 | 6 | 7 | SIG | 5V | GND | SIG | 5V | GND | SIG | 5V | GND
tNames: - | + | X | Y | Z | POWER | 2B | 2A | 16-20 VDC | 2B | 2A | 1A | 1B | 2B | 2A | 1A | 1B | 1A | 1B | 5V | GND | 13 | 12 | 11 | 10 | 9 | 8 | 22 | 23 | + | + | - | GND | - | LED10 | 5V | + | OUT | EXP1 | EN | EN | MicroStep | None = Full Step | MS1 = Half Step | MS2 = QuarterStep | GND | EN | MS1&2 = 1/8 Step | 5V | MS1 | MS2 | MS3 | MS1 | MS2 | MS3 | MS1 | MS2 | MS3 | MS1&2&3=1/16th St. | LED9 | MS3,2,1 | MS3,2,1 | EXP2 | EN | EN | LED8 | 52 | 53 | - | - | - | Ultimaker.com | INFO: ultimaker.com/pcb1.5.6 | + | + | + | Version 1.5.6 | 12 V OUTPUT | JJ/SW/EdB | LEDs | ANALOG IN | LED6 | LED7 | A | 1B | 1A | 2A | 2B | 1B | 1A | 2A | 2B | - | A | + | EXT